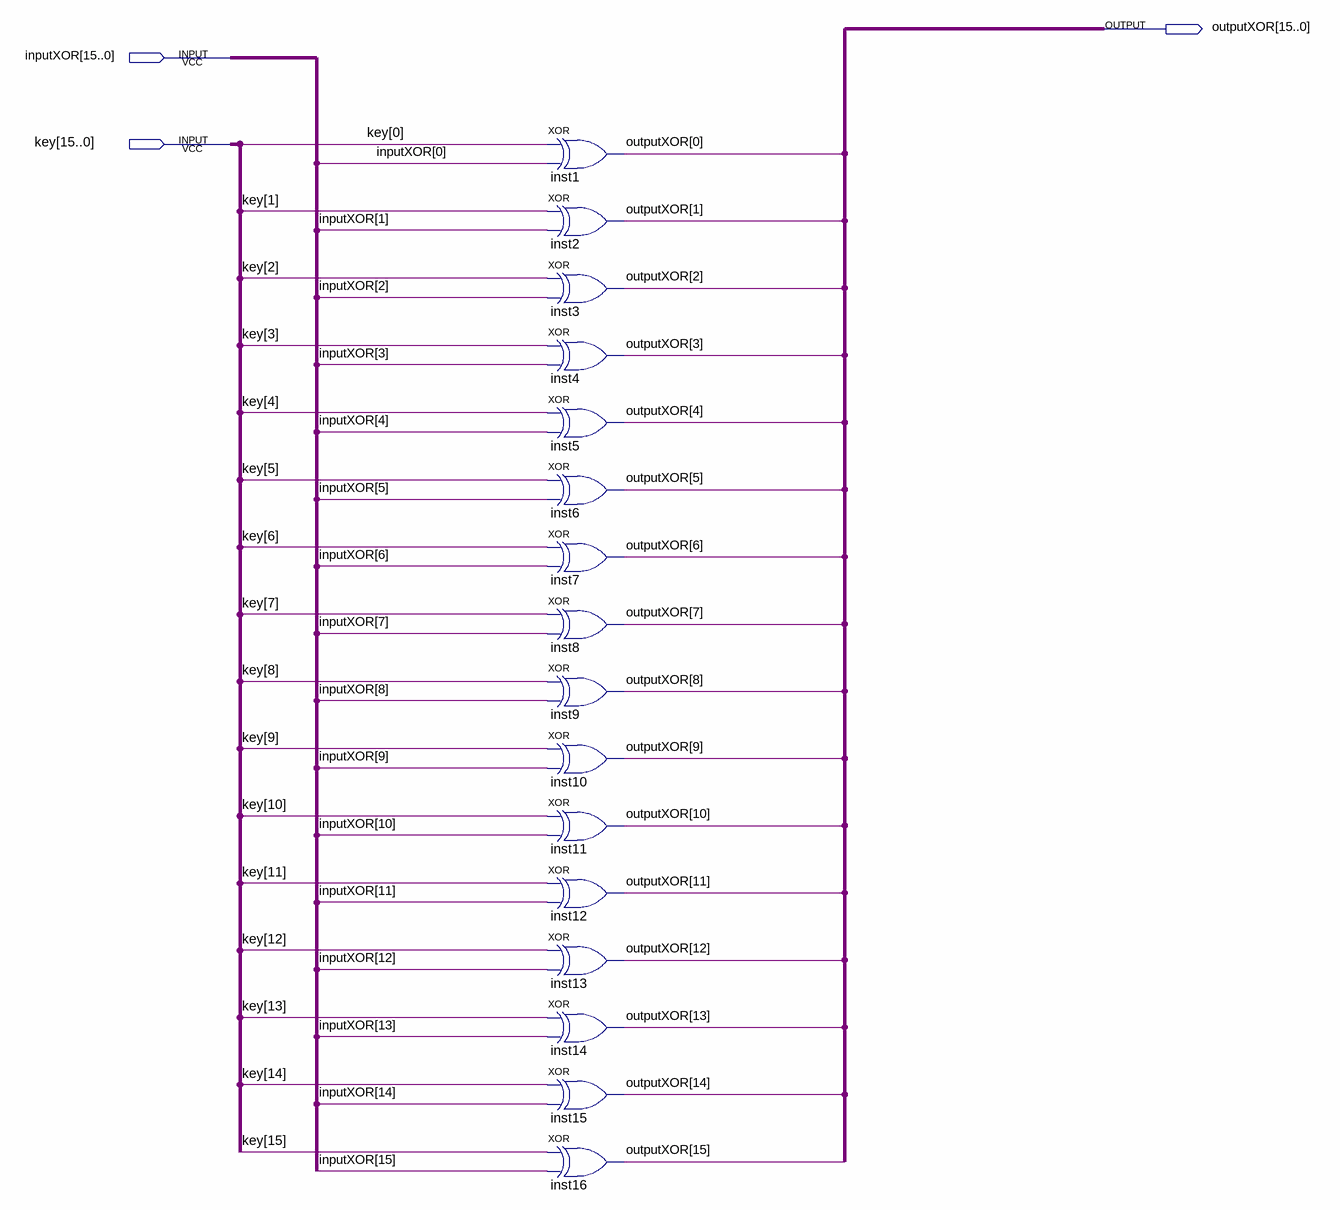
[diagram p0: schematic sheet]
// Quartus schematic BlockXOR.bdf as structural Verilog: 16 symbols, 3 pins
module BlockXOR (
  input  [15:0] inputXOR,
  input  [15:0] key,
  output [15:0] outputXOR
);

  xor inst1 (outputXOR[0], key[0], inputXOR[0]);
  xor inst2 (outputXOR[1], key[1], inputXOR[1]);
  xor inst3 (outputXOR[2], key[2], inputXOR[2]);
  xor inst4 (outputXOR[3], key[3], inputXOR[3]);
  xor inst5 (outputXOR[4], key[4], inputXOR[4]);
  xor inst6 (outputXOR[5], key[5], inputXOR[5]);
  xor inst7 (outputXOR[6], key[6], inputXOR[6]);
  xor inst8 (outputXOR[7], key[7], inputXOR[7]);
  xor inst9 (outputXOR[8], key[8], inputXOR[8]);
  xor inst10 (outputXOR[9], key[9], inputXOR[9]);
  xor inst11 (outputXOR[10], key[10], inputXOR[10]);
  xor inst12 (outputXOR[11], key[11], inputXOR[11]);
  xor inst13 (outputXOR[12], key[12], inputXOR[12]);
  xor inst14 (outputXOR[13], key[13], inputXOR[13]);
  xor inst15 (outputXOR[14], key[14], inputXOR[14]);
  xor inst16 (outputXOR[15], key[15], inputXOR[15]);
endmodule
